# Altium schematic sheet Battery Measurement.SchDoc: Battery Measurement With I2C Isolation
size A4; SheetNumber: 4; SheetTotal: 37
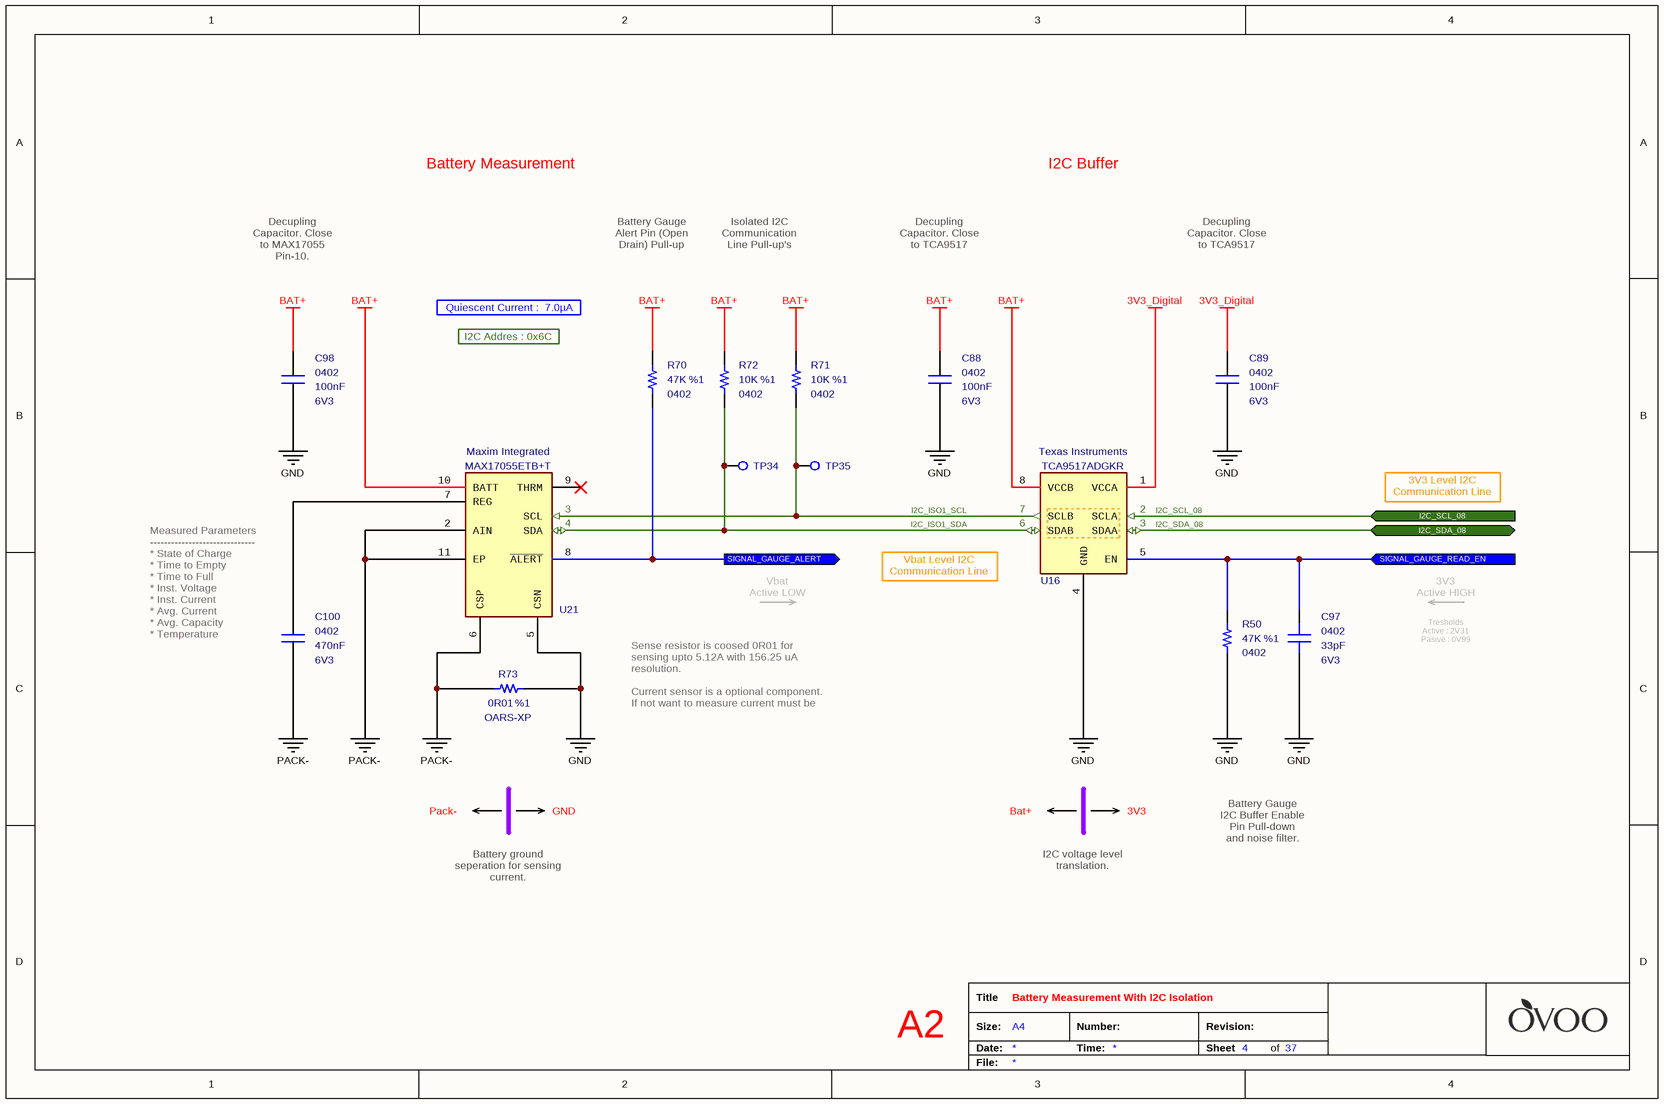
[diagram p0: Battery Measurement.SchDoc]

## Parts
C88  value 100nF  Case: 0402  Voltage: 6V3  [CAPACITOR_0402]  (hidden comment: Multilayer Ceramic Capacitor)
C89  value 100nF  Case: 0402  Voltage: 6V3  [CAPACITOR_0402]  (hidden comment: Multilayer Ceramic Capacitor)
C97  value 33pF  Case: 0402  Voltage: 6V3  [CAPACITOR_0402]  (hidden comment: Multilayer Ceramic Capacitor)
C98  value 100nF  Case: 0402  Voltage: 6V3  [CAPACITOR_0402]  (hidden comment: Multilayer Ceramic Capacitor)
C100  value 470nF  Case: 0402  Voltage: 6V3  [CAPACITOR_0402]  (hidden comment: Multilayer Ceramic Capacitors)
R50  value 47K  Tolerance: %1  Case: 0402  [RESISTOR_0402]  (hidden comment: Thick Film Resistor)
R70  value 47K  Tolerance: %1  Case: 0402  [RESISTOR_0402]  (hidden comment: Thick Film Resistor)
R71  value 10K  Tolerance: %1  Case: 0402  [RESISTOR_0402]  (hidden comment: Thick Film Resistor)
R72  value 10K  Tolerance: %1  Case: 0402  [RESISTOR_0402]  (hidden comment: Thick Film Resistor)
R73  value 0R01  Case: OARS-XP  Tolerance: %1  [RESISTOR_OARSXP]  (hidden comment: Current Sense Resistor)
TP34  PCB - Test Point  [Test_Pad - Hole]  (value not drawn)  (no BOM)
TP35  PCB - Test Point  [Test_Pad - Hole]  (value not drawn)  (no BOM)
U16  Manufacturer_Name: Texas Instruments  Manufacturer_Part_Number: TCA9517ADGKR  [MSOP-8-4]  (hidden comment: I2C Bus Repeater)
U21  Manufacturer_Part_Number: MAX17055ETB+T  Manufacturer_Name: Maxim Integrated  [TDFN-10]  (hidden comment: Battery Gauge)

## Ports
I2C_SCL_08 (in), I2C_SDA_08 (bidir), SIGNAL_GAUGE_ALERT (out), SIGNAL_GAUGE_READ_EN (in)

## Nets
3V3_Digital: C89.1 U16.1(VCCA)
BAT+: C88.1 C98.1 R70.2 R71.2 R72.2 U16.8(VCCB) U21.10(BATT)
GND: C88.2 C89.2 C97.1 C98.2 R50.1 R73.1 U16.4(GND) U21.5(CSN)
PACK-: C100.1 R73.2 U21.2(AIN) U21.6(CSP) U21.11(EP)
I2C_ISO1_SCL: R71.1 TP35.1(TP) U16.7(SCLB) U21.3(SCL)
I2C_ISO1_SDA: R72.1 TP34.1 U16.6(SDAB) U21.4(SDA)
I2C_SCL_08: U16.2(SCLA) ; port I2C_SCL_08
I2C_SDA_08: U16.3(SDAA) ; port I2C_SDA_08
SIGNAL_GAUGE_ALERT: R70.1 U21.8(~{ALERT}) ; port SIGNAL_GAUGE_ALERT
SIGNAL_GAUGE_READ_EN: C97.2 R50.2 U16.5(EN) ; port SIGNAL_GAUGE_READ_EN
NetC100_2: C100.2 U21.7(REG)

Not connected (* = marked no-connect by the designer): U21 9(THRM)*

## Notes on the sheet
- Battery Measurement
- I2C Buffer
- Decupling Capacitor. Close to MAX17055 Pin-10.
- Battery Gauge Alert Pin (Open Drain) Pull-up
- Isolated I2C Communication Line Pull-up's
- Decupling Capacitor. Close to TCA9517 Pin-8.
- Decupling Capacitor. Close to TCA9517 Pin-1.
- Quiescent Current :  7.0µA
- I2C Addres : 0x6C
- 3V3 Level I2C
  Communication Line
- Vbat
  Active LOW
- (near U16) Vbat Level I2C
  Communication Line
- 3V3
  Active HIGH
- (near C100) Measured Parameters
  ------------------------------
  * State of Charge
  * Time to Empty
  * Time to Full
  * Inst. Voltage
  * Inst. Current
  * Avg. Current
  * Avg. Capacity
  * Temperature
- Tresholds
  Active : 2V31
  Pasive : 0V99
- Sense resistor is coosed 0R01 for sensing upto 5.12A with 156.25 uA resolution.
  Current sensor is a optional component. If not want to measure current must be connect PACK- to GND.
- Pack-
- GND
- Bat+
- 3V3
- Battery Gauge I2C Buffer Enable Pin Pull-down and noise filter.
- Battery ground seperation for sensing current.
- I2C voltage level translation.
- A2
- Title
- Size:
- Date:
- A4
- Number:
- Time:
- Revision:
- Sheet
- of
- File:

## Library data of the parts
C88 C89 C98 = Capacitor - 100nF [0402-6V3]: Capacitor - 100nF [0402-6V3] (Ceramic); Manufacturer_Name: AVX; Manufacturer_Part_Number: 04026D104KAT4A; Dielectric: X5R; Tolerance: %10; Height: 0.25mm; Mouser_Part_Number: 581-04026D104KAT4A; ComponentLink1Description: Mouser; ComponentLink1URL: https://www.mouser.com.tr/ProductDetail/AVX/04026D104KAT4A?qs=sGAEpiMZZMs0AnBnWHyRQPg4iYkCw7IMED%2F4kpqgf7w%3D; ComponentLink2Description: DataSheet; ComponentLink2URL: https://www.mouser.com.tr/datasheet/2/40/cx5r-776519.pdf; ROHS: Yes; Maximum Operating Temperature: +85; Minimum Operating Temperature: -55; Supplier 1: Avnet; Supplier Part Number 1: 04026D104KAT4A
C97 = Capacitor - 33pF [0402-6V3]: Capacitor - 33pF [0402] (Ceramic); Manufacturer_Name: Kemet; Manufacturer_Part_Number: C0402C330J9RACAUTO; Dielectric: X7R; Tolerance: 10%; Height: 0.5mm; Mouser_Part_Number: 80-C0402C330J9RAUTO; Maximum Operating Temperature: +125; Minimum Operating Temperature: -55; ROHS: Yes; ComponentLink1Description: DataSheet; ComponentLink1URL: https://api.kemet.com/component-edge/download/datasheet/C0402C330J9RACAUTO.pdf; ComponentLink2Description: Mouser; ComponentLink2URL: https://www.mouser.com/Search/Refine.aspx?Keyword=80-C0402C330J9RAUTO; Supplier 1: Mouser; Supplier Part Number 1: 80-C0402C330J9RAUTO
C100 = Capacitor - 470nF [0402-6V3]: Capacitor - 470nF [0402] (Ceramic); Manufacturer_Name: AVX; Manufacturer_Part_Number: 04026C474KAT2A; Dielectric: X7R; Tolerance: %10; Height: 0.4mm; Mouser_Part_Number: 581-04026C474KAT2A; ComponentLink1Description: Mouser; ComponentLink1URL: https://www.mouser.com.tr/ProductDetail/AVX/04026D104KAT4A?qs=sGAEpiMZZMs0AnBnWHyRQPg4iYkCw7IMED%2F4kpqgf7w%3D; ComponentLink2Description: DataSheet; ComponentLink2URL: https://www.mouser.com.tr/datasheet/2/40/cx5r-776519.pdf; ROHS: Yes; Maximum Operating Temperature: +125; Minimum Operating Temperature: -55; Supplier 1: Mouser; Supplier Part Number 1: 581-04026C474KAT2A
R50 R70 = Resistor - 47K: Thick Film Resistors - SMD 1/16 W 47 Kohms 1%; Manufacturer_Name: Vishay; Manufacturer_Part_Number: CRCW040247K0FKED; Height: 0.4mm; Mouser_Part_Number: 71-CRCW0402-47K-E3; ComponentLink1Description: DataSheet; ComponentLink1URL: https://www.mouser.com.tr/datasheet/2/427/dcrcwe3-1762152.pdf; ComponentLink2Description: Mouser; ComponentLink2URL: https://www.mouser.com.tr/ProductDetail/Vishay-Dale/CRCW040247K0FKED?qs=sGAEpiMZZMu61qfTUdNhG2DpbjADlD3GL%252B3h1elTxqU%3D; Supplier 1: Mouser; Supplier 2: Digi-Key; Supplier Part Number 1: 71-CRCW040247K0FKEDH; Supplier Part Number 2: 541-47.0KYCT-ND
R71 R72 = Resistor - 10K: Thick Film Resistors - SMD 1/16 W 10 Kohms 1%; Manufacturer_Name: Vishay; Manufacturer_Part_Number: CRCW040210K0FKED; Height: 0.4mm; Mouser_Part_Number: 71-CRCW0402-10K-E3; ComponentLink1Description: DataSheet; ComponentLink1URL: https://www.mouser.com.tr/datasheet/2/427/dcrcwe3-1762152.pdf; ComponentLink2Description: Mouser; ComponentLink2URL: https://www.mouser.com.tr/ProductDetail/Vishay-Dale/CRCW040210K0FKED?qs=sGAEpiMZZMu61qfTUdNhG2DpbjADlD3GcalbOv9utCY%3D; Supplier 1: Mouser; Supplier 2: Digi-Key; Supplier Part Number 1: 71-CRCW040210K0FKEDH; Supplier Part Number 2: 541-10.0KYCT-ND
R73 = Resistor - 0R01 (Current Sense): Current Sense Resistors - SMD 10 W 0.01 ohms 1%; Manufacturer_Name: TT Electronics; Manufacturer_Part_Number: OARSXPR010FLF; Height: 4.57mm; Mouser_Part_Number: 66-OARSXPR010FLF; ComponentLink1Description: DataSheet; ComponentLink1URL: https://www.mouser.com.tr/datasheet/2/414/OARS-1528401.pdf; ComponentLink2Description: Mouser; ComponentLink2URL: https://www.mouser.com.tr/ProductDetail/Welwyn-Components-TT-Electronics/OARSXPR010FLF?qs=sGAEpiMZZMtlleCFQhR%2FzeTNl4NhfdapppP6XDTtD%252Bk%3D; Supplier 1: Mouser; Supplier 2: Arrow; Supplier Part Number 1: 66-OARSXPR010FLF; Supplier Part Number 2: OARSXPR010FLF
TP34 TP35 = PCB - Test Point: Test Point
U16 = IC - TCA9517ADGKR: Interface - Signal Buffers, Repeaters Level-Translting I2C Bus Repeater; Propagation Delay Time: 141 nS; Operating Supply Voltage: 900 mV to 5.5 V; Operating Supply Current: 1mA; Ciss - Input Capacitance: 8pF; Height: 1.1mm; Mouser Part Number: 595-TCA9517ADGKR; ComponentLink1Description: DataSheet; ComponentLink1URL: http://www.ti.com/general/docs/suppproductinfo.tsp?distId=26&gotoUrl=http%3A%2F%2Fwww.ti.com%2Flit%2Fgpn%2Ftca9517a; ComponentLink2Description: Mouser; ComponentLink2URL: https://www.mouser.com.tr/ProductDetail/Texas-Instruments/TCA9517ADGKR?qs=%252BrH4t%252BeVZ2M4pVnwXR4oNA==; Minimum Operating Temperature: -40; Maximum Operating Temperature: +85; Case: VSSOP-8; Supplier 1: Mouser; Supplier 2: Digi-Key; Supplier Part Number 1: 595-TCA9517ADGKR; Supplier Part Number 2: 296-39220-1-ND
U21 = IC - MAX17055ETB+T: Battery Management Stand-Alone ModelGauge m5 Fuel Gauge; Battery Type: Li-Ion, LiFePO4; Operating Supply Current: 18 uA; Operating Supply Voltage: 2.3 V to 4.9 V; Height: 0.8mm; Mouser_Part_Number: 700-MAX17055ETB+T; ComponentLink1Description: DataSheet; ComponentLink1URL: https://www.mouser.com.tr/datasheet/2/256/MAX17055-1097125.pdf; ComponentLink2Description: Mouser; ComponentLink2URL: https://www.mouser.com.tr/ProductDetail/Maxim-Integrated/MAX17055ETB%2bT?qs=sGAEpiMZZMve4%2FbfQkoj%252BAs6FTSsQJaJrD7Z3v0Qe9M%3D; Minimum Operating Temperature: -40; Maximum Operating Temperature: +85; Case: TDFN-10; Supplier 1: Mouser; Supplier 2: Digi-Key; Supplier Part Number 2: MAX17055ETB+TCT-ND; Supplier Part Number 1: 700-MAX17055ETB+T